# Altium schematic sheet hierarchical_schematic_top.SchDoc
size A4; SheetNumber: 1; SheetTotal: 3
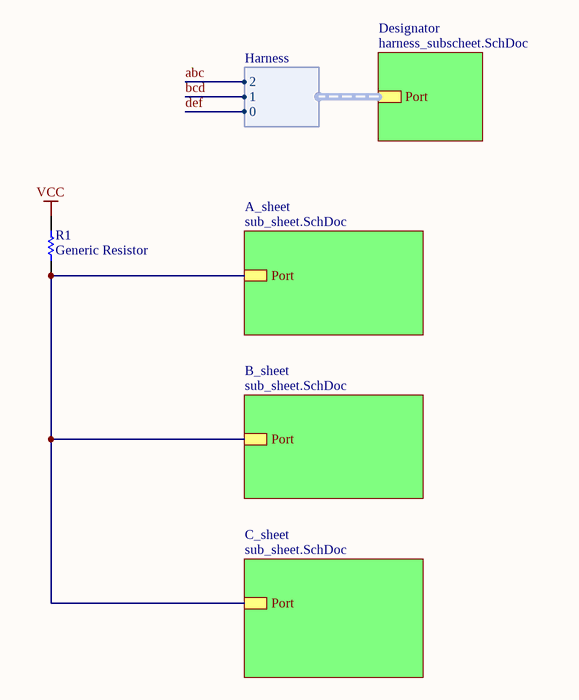
[diagram p0: hierarchical_schematic_top.SchDoc]

## Parts
R1  Generic Resistor

## Sub-sheets
A_sheet = sub_sheet.SchDoc: Port
B_sheet = sub_sheet.SchDoc: Port
C_sheet = sub_sheet.SchDoc: Port
Designator = harness_subscheet.SchDoc: Port (harness Harness)

## Harnesses
Harness: 0, 1, 2

## Nets
VCC: R1.2
abc: sheet Designator/Port.2
bcd: sheet Designator/Port.1
def: sheet Designator/Port.0
NetR1_1: R1.1 ; sheet A_sheet/Port, sheet B_sheet/Port, sheet C_sheet/Port

## Library data of the parts
R1 = CMP-441e8da1a4a89bd9-1: Lead Length: 10mm; Power Rating: 2.00 W; ELV Compliant: Compliant; Resistance Tolerance: ±5%; Resistance: 100 Ω; Temperature Coefficient: -350 ppm/°C to 350 ppm/°C; Voltage Rating (DC): 350 V; Packaging: Ammo Pack; OctopartID: 441e8da1a4a89bd9; RoHS: Compliant; Lifecycle Status: Active; REACH SVHC Compliance: No SVHC; Operating Temperature: -55.0 °C to 235 °C; Mounting Style: Axial; Number of Pins: 2